# EAGLE design AccessPanelV4 (EAGLE 8.2.2)
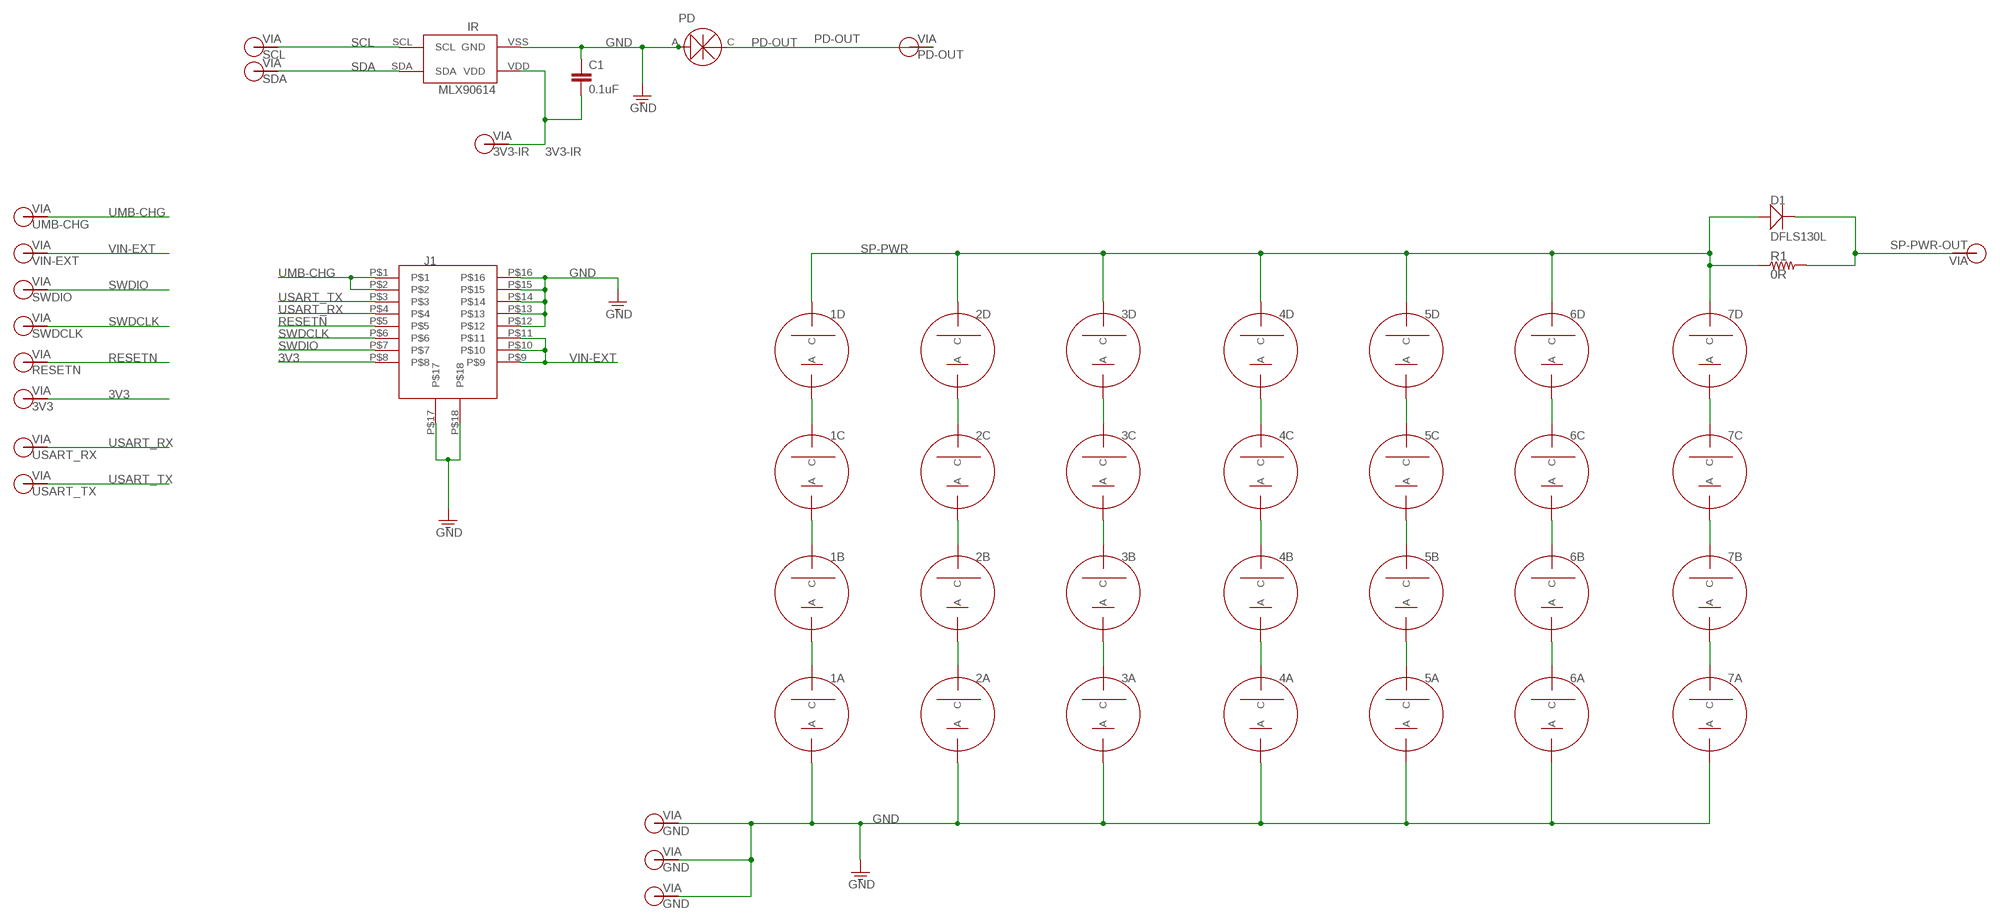
[diagram p0: schematic, sheet 1]

## Parts
1A  SOLARCELLV3  [TRISOLX-V3]
1B  SOLARCELLV3  [TRISOLX-V3]
1C  SOLARCELLV3  [TRISOLX-V3]
1D  SOLARCELLV3  [TRISOLX-V3]
2A  SOLARCELLV3  [TRISOLX-V3]
2B  SOLARCELLV3  [TRISOLX-V3]
2C  SOLARCELLV3  [TRISOLX-V3]
2D  SOLARCELLV3  [TRISOLX-V3]
3A  SOLARCELLV3  [TRISOLX-V3]
3B  SOLARCELLV3  [TRISOLX-V3]
3C  SOLARCELLV3  [TRISOLX-V3]
3D  SOLARCELLV3  [TRISOLX-V3]
4A  SOLARCELLV3  [TRISOLX-V3]
4B  SOLARCELLV3  [TRISOLX-V3]
4C  SOLARCELLV3  [TRISOLX-V3]
4D  SOLARCELLV3  [TRISOLX-V3]
5A  SOLARCELLV3  [TRISOLX-V3]
5B  SOLARCELLV3  [TRISOLX-V3]
5C  SOLARCELLV3  [TRISOLX-V3]
5D  SOLARCELLV3  [TRISOLX-V3]
6A  SOLARCELLV3  [TRISOLX-V3]
6B  SOLARCELLV3  [TRISOLX-V3]
6C  SOLARCELLV3  [TRISOLX-V3]
6D  SOLARCELLV3  [TRISOLX-V3]
7A  SOLARCELLV3  [TRISOLX-V3]
7B  SOLARCELLV3  [TRISOLX-V3]
7C  SOLARCELLV3  [TRISOLX-V3]
7D  SOLARCELLV3  [TRISOLX-V3]
C1  0.1uF  CAP0805  [0805]
D1  DFLS130L  [PWRDI-123]
IR  MXL90614  [MXL90620]
J1  FFC-16  [68611614422]
PD  TEMD6200  [TEMD6200]
R1  0R  RES1210  [1210]
SCL  SCL  VIA-60MIL  [VIA-60MIL]
SDA  SDA  VIA-60MIL  [VIA-60MIL]
V1  SP-PWR-OUT  VIA-60MIL  [VIA-60MIL]
V2  GND  VIA-60MIL  [VIA-60MIL]
V3  3V3-IR  VIA-60MIL  [VIA-60MIL]
V4  GND  VIA-60MIL  [VIA-60MIL]
V5  GND  VIA-60MIL  [VIA-60MIL]
V6  PD-OUT  VIA-60MIL  [VIA-60MIL]
V7  UMB-CHG  VIA-60MIL  [VIA-60MIL]
V8  VIN-EXT  VIA-60MIL  [VIA-60MIL]
V9  SWDIO  VIA-60MIL  [VIA-60MIL]
V10  SWDCLK  VIA-60MIL  [VIA-60MIL]
V11  RESETN  VIA-60MIL  [VIA-60MIL]
V14  USART_RX  VIA-60MIL  [VIA-60MIL]
V15  USART_TX  VIA-60MIL  [VIA-60MIL]
V16  3V3  VIA-60MIL  [VIA-60MIL]

## Nets
3V3: J1.P$8 V16.P$1
3V3-IR: C1.2 IR.VDD V3.P$1
GND: 1A.ANODE(A) 2A.ANODE(A) 3A.ANODE(A) 4A.ANODE(A) 5A.ANODE(A) 6A.ANODE(A) 7A.ANODE(A) C1.1 IR.VSS(GND) J1.P$12 J1.P$13 J1.P$14 J1.P$15 J1.P$16 J1.P$17 J1.P$18 PD.A V2.P$1 V4.P$1 V5.P$1
N$1: 1C.CATHODE(C) 1D.ANODE(A)
N$3: 2C.CATHODE(C) 2D.ANODE(A)
N$4: 3C.CATHODE(C) 3D.ANODE(A)
N$5: 4C.CATHODE(C) 4D.ANODE(A)
N$6: 5C.CATHODE(C) 5D.ANODE(A)
N$7: 1A.CATHODE(C) 1B.ANODE(A)
N$9: 2A.CATHODE(C) 2B.ANODE(A)
N$10: 3A.CATHODE(C) 3B.ANODE(A)
N$11: 4A.CATHODE(C) 4B.ANODE(A)
N$12: 5A.CATHODE(C) 5B.ANODE(A)
N$13: 1B.CATHODE(C) 1C.ANODE(A)
N$15: 2B.CATHODE(C) 2C.ANODE(A)
N$16: 3B.CATHODE(C) 3C.ANODE(A)
N$17: 4B.CATHODE(C) 4C.ANODE(A)
N$18: 5B.CATHODE(C) 5C.ANODE(A)
N$19: 6C.CATHODE(C) 6D.ANODE(A)
N$20: 6A.CATHODE(C) 6B.ANODE(A)
N$21: 6B.CATHODE(C) 6C.ANODE(A)
N$22: 7C.CATHODE(C) 7D.ANODE(A)
N$23: 7A.CATHODE(C) 7B.ANODE(A)
N$24: 7B.CATHODE(C) 7C.ANODE(A)
PD-OUT: PD.C V6.P$1
RESETN: J1.P$5 V11.P$1
SCL: IR.SCL SCL.P$1
SDA: IR.SDA SDA.P$1
SP-PWR: 1D.CATHODE(C) 2D.CATHODE(C) 3D.CATHODE(C) 4D.CATHODE(C) 5D.CATHODE(C) 6D.CATHODE(C) 7D.CATHODE(C) D1.A R1.P$1
SP-PWR-OUT: D1.C R1.P$2 V1.P$1
SWDCLK: J1.P$6 V10.P$1
SWDIO: J1.P$7 V9.P$1
UMB-CHG: J1.P$1 J1.P$2 V7.P$1
USART_RX: J1.P$4 V14.P$1
USART_TX: J1.P$3 V15.P$1
VIN-EXT: J1.P$9 J1.P$10 J1.P$11 V8.P$1

## Notes on the sheet
- GND | PD-OUT

## Library data of the parts
1A 1B 1C 1D 2A 2B 2C 2D 3A 3B 3C 3D 4A 4B 4C 4D 5A 5B 5C 5D 6A 6B 6C 6D 7A 7B 7C 7D = BrownSpaceEngineering:SOLARCELLV3
C1 = CNTRL_BOARD:CAP: Capacitor Standard 0603 ceramic capacitor, and 0.1" leaded capacitor.
D1 = BrownSpaceEngineering:DFLS130L
IR = CNTRL_BOARD:MXL90614
J1 = BrownSpaceEngineering:FFC-16
PD = BrownSpaceEngineering:TEMD6200
R1 = BrownSpaceEngineering:RES
SCL SDA V1-V11 V14-V16 = BrownSpaceEngineering:VIA

## Board
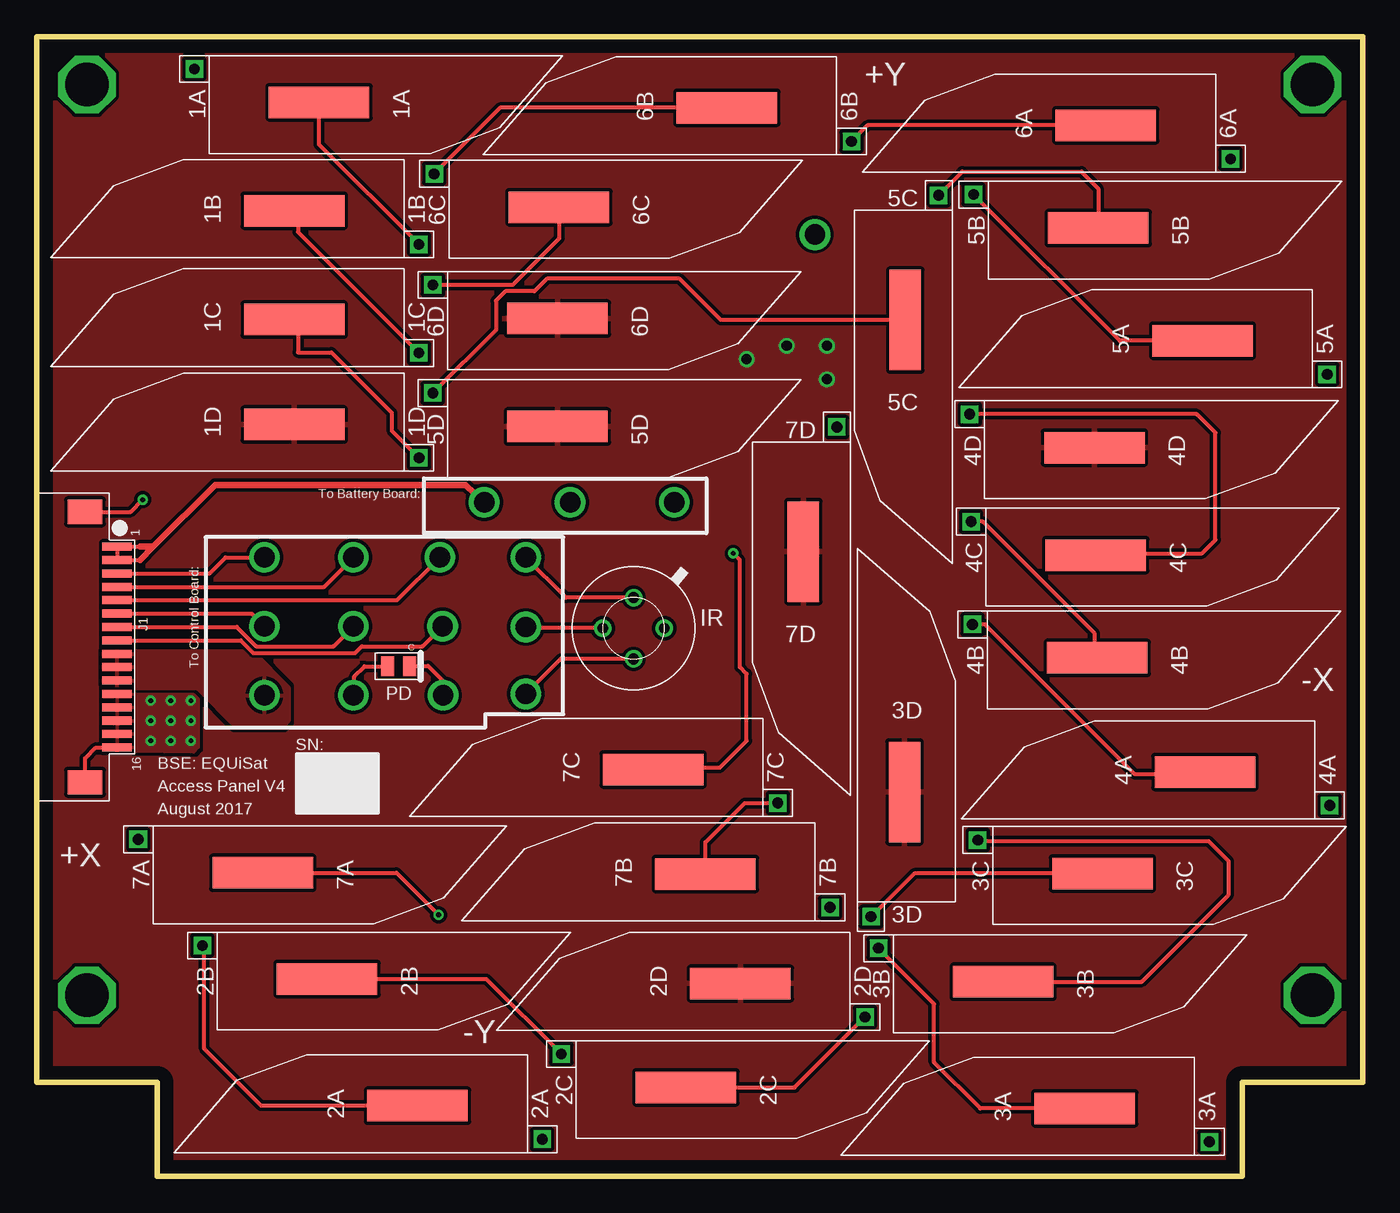
[diagram p1: board, top side]
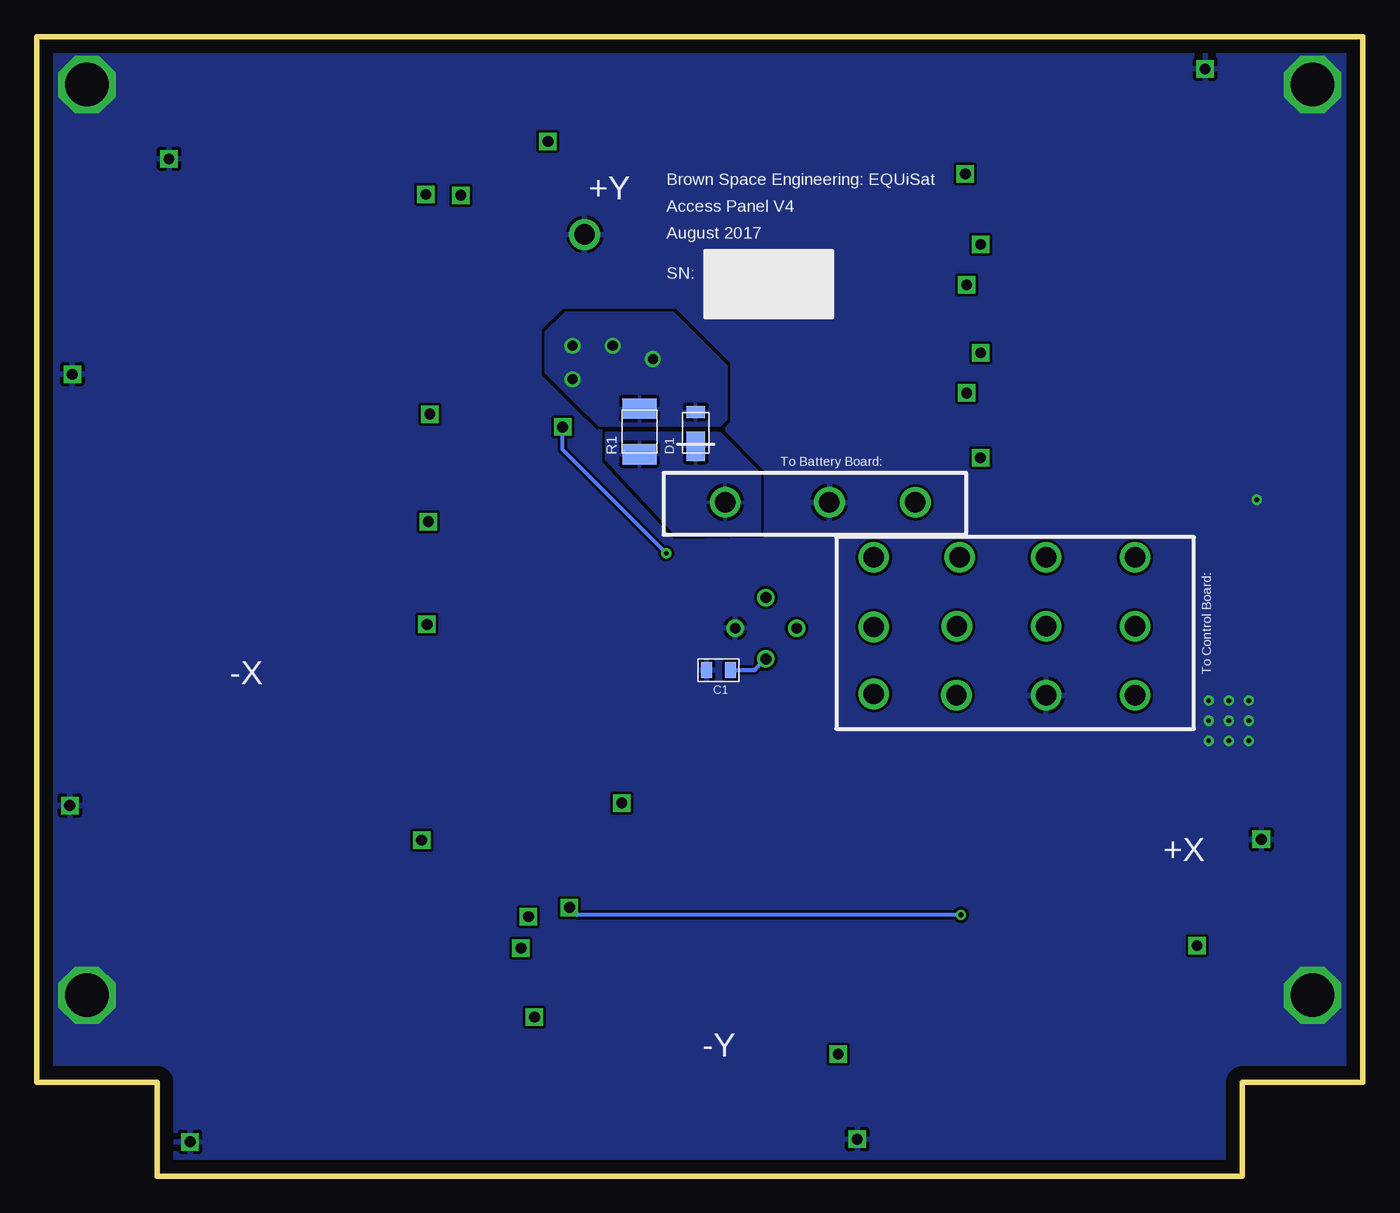
[diagram p2: board, bottom side, seen from below]

Size 99 x 85.07 mm. Coordinates in mm from the lower left corner, seen from the top.
Outline: 9,0 9,7 0,7 0,85.07 99,85.07 99,7 90,7 90,0 9,0
Copper layers (1*16): Top 0.035mm / dielectric 1.5mm / Bottom 0.035mm
Design rules "default": minimum track width 10mil, minimum drill 24mil, track to track 8mil, track to pad 8mil, pad to pad 8mil, via to via 8mil, smd to smd 8mil, copper to edge 40mil, drill to drill 8mil, minimum pad ring 10mil, minimum via ring 8mil, stop-mask expansion 4mil, vias tented up to drill 0mil, thermal gap 10mil

### Footprints (pad centres in the part's own frame; a part is rotated, then mirrored left to right if it is on the bottom)
TRISOLX-V3 = drill 0.8 square: ANODE 13.53,-1.54 | smd 7.5 x 2.35: CATHODE 4.22,0.96
0805 = smd 0.8 x 1.2: 1 -0.9,0; 2 0.9,0
PWRDI-123 = smd 0.9 x 1.4: A 1.45,0 | smd 2.2 x 1.4: C -1.1,0
MXL90620 = drill 0.8: SCL 2.293,0; VDD -2.293,0; VSS 0,-2.294 | drill 0.8 pad 1.2: SDA 0,2.294
68611614422 = smd 0.6 x 2.2: P$1 0,0; P$2 1,0; P$3 2,0; P$4 3,0; P$5 4,0; P$6 5,0; P$7 6,0; P$8 7,0; P$9 8,0; P$10 9,0; P$11 10,0; P$12 11,0; P$13 12,0; P$14 13,0; P$15 14,0; P$16 15,0 | smd 1.8 x 2.6: P$17 17.6,-2.4; P$18 -2.6,-2.4
TEMD6200 = smd 1 x 1.45: A 0.76,0.4; C -0.88,0.4
1210 = smd 1.52 x 2.54: P$1 -1.71,0 | smd 1.51 x 2.54: P$2 1.71,0
VIA-60MIL = drill 1.524: P$1 0,0

### Placement (x,y rotation side)
1A  25.29,81.13 180 top
1B  15,71.11 0 top
1C  15,63 0 top
1D  15.01,55.17 0 top
2A  24.21,4.29 0 top
2B  25.89,15.67 180 top
2C  52.69,7.57 180 top
2D  48.31,13.41 0 top
3A  74.03,4.09 0 top
3B  76.37,15.47 180 top
3C  83.79,23.55 180 top
3D  63.83,32.89 270 top
4A  83.01,29.21 0 top
4B  83.39,39.65 180 top
4C  83.29,47.33 180 top
4D  83.19,55.35 180 top
5A  82.83,61.41 0 top
5B  83.47,71.75 180 top
5C  65.81,59.71 90 top
5D  43.09,56.93 180 top
6A  75.6,77.5 0 top
6B  47.3,78.8 0 top
6C  43.2,73.3 180 top
6D  43.1,65 180 top
7A  21.1,23.6 180 top
7B  45.7,21.6 0 top
7C  41.8,29.4 0 top
7D  58.2,42.4 90 top
C1  48.1,37.78 0 bottom
D1  49.8,55.6 90 bottom
IR  44.56,40.91 90 top
J1  6,47 270 top
PD  26.95,38.47 180 top
R1  54,55.6 270 bottom
SCL  36.5,46.2 180 top
SDA  36.5,41 180 top
V1  47.6,50.3 180 top
V2  39.82,50.3 180 top
V3  36.5,36 0 top
V4  58.1,70.3 180 top
V5  23.65,35.9 180 top
V6  30.34,35.91 180 top
V7  33.4,50.3 180 top
V8  17,35.9 180 top
V9  23.65,41.05 180 top
V10  17,41.05 180 top
V11  30.1,46.2 180 top
V14  23.65,46.2 180 top
V15  17,46.2 180 top
V16  30.3,41.05 180 top

### Tracks (layer width: path | path; a pad name or v marks a point on that pad's centre or on a via)
3V3
  Top 0.3: J1.P$8 15.22,40 16.17,39.05 23.77,39.05 24.27,39.55 28.8,39.55 V16.P$1
3V3-IR
  Top 0.3: IR.VDD 39.11,38.61 V3.P$1
  Bottom 0.3: C1.2 45.4,37.77 IR.VDD
GND  (via drill 0.35, 3.26)
  Top 0.3: J1.P$17 3.6,31.2 4.4,32 J1.P$16 | J1.P$18 7,49.6 v7.9,50.5 | V5.P$1 23.7,35.9 23.7,37.3 24.47,38.07 PD.A
  other vias: 3.75,13.5 95.25,13.5 95.25,81.5 3.75,81.5 10,34 10,35.5 11.5,35.5 11.5,34 11.5,32.5 8.5,35.5 8.5,34 8.5,32.5 10,32.5
  pour Bottom (rank 3): -4.21,107.98 115.7,107.98 116.1,97.91 124.31,97.91 125.31,-15.1 -9.71,-15.1 -9.81,-14.24 -12.11,-14.24 -13.01,98.57 -3.81,98.57
  pour Top (rank 2): 5,36.4 11.9,36.3 12.1,36.1 12.1,32 11.7,31.6 5,31.7
N$1
  Top 0.3: 1D.ANODE 26.5,55.67 26.5,57 22,61.5 19.5,61.5 19.5,63.68 1C.CATHODE 21.04,63.96 22,63
N$3
  Top 0.3: 2C.CATHODE 56.58,6.61 2D.ANODE
N$4
  Top 0.3: 3C.CATHODE 65.52,22.59 3D.ANODE
N$5
  Top 0.3: 4C.CATHODE 79,46.44 79,46.5 87,46.5 88,47.5 88,55.5 86.61,56.89 4D.ANODE
N$6
  Top 0.3: 5C.CATHODE 51.07,63.93 48,67 38.09,67 37.16,66.07 34.98,66.07 34.28,65.36 34.28,63.19 5D.ANODE
N$7
  Top 0.3: 1B.ANODE 21.07,77.03 1A.CATHODE
N$9
  Top 0.3: 2A.CATHODE 16.75,5.25 12.5,9.5 12.5,17.07 2B.ANODE
N$10
  Top 0.3: 3A.CATHODE 70.45,5.05 67,8.5 67,12.85 3B.ANODE
N$11
  Top 0.3: 4A.CATHODE 87.06,30 82,30 70.81,41.19 4B.ANODE
N$12
  Top 0.3: 5A.CATHODE 80.86,62.37 5B.ANODE
N$13
  Top 0.3: 28.04,61.46 1C.ANODE 19.5,70.49 19.5,71.79 1B.CATHODE
N$15
  Top 0.3: 2B.CATHODE 33.56,14.71 2C.ANODE
N$16
  Top 0.3: 3B.CATHODE 82.51,14.51 89,21 89,23.5 87.5,25 70.35,25 3C.ANODE
N$17
  Top 0.3: 4B.CATHODE 79,38.86 79,40.5 70.63,48.87 4C.ANODE
N$18
  Top 0.3: 79.25,71.25 5B.CATHODE 79.25,73.75 78,75 69.11,75 5C.ANODE
N$19
  Top 0.3: 6C.CATHODE 38.98,70.02 39,70 35.54,66.54 6D.ANODE
N$20
  Top 0.3: 6A.CATHODE 62.03,78.46 6B.ANODE
N$21
  Top 0.3: 6B.CATHODE 34.59,79.76 6C.ANODE
N$22  (via drill 0.35)
  Top 0.3: 7C.CATHODE 46.16,30.5 51,30.5 53,32.5 53,37.5 52.5,38 52.5,46 v52,46.5
  Bottom 0.3: v52,46.5 59.74,54.24 7D.ANODE
N$23  (via drill 0.35)
  Top 0.3: 7A.CATHODE 26.86,22.64 v30,19.5
  Bottom 0.3: v30,19.5 58.67,19.5 7B.ANODE
N$24
  Top 0.3: 7B.CATHODE 49.92,24.92 52.86,27.86 7C.ANODE
N$25
  Top 0.25: 99,85.07 99,7 90,7 90,0 9,0 9,7 0,7 0,85.07 99,85.07
PD-OUT
  Top 0.3: PD.C 27.86,38.1 29.2,38.1 30.34,36.96 V6.P$1
RESETN
  Top 0.3: J1.P$5 26.9,43 V11.P$1
SCL
  Top 0.3: IR.SCL 39.5,43.2 SCL.P$1
SDA
  Top 0.3: IR.SDA 36.59,40.91 SDA.P$1
SP-PWR  (via drill 0.76)
  other vias: 53,61 56,62 59,59.5 59,62
  pour Top (isolate 0.254, rank 3): 107.53,106.8 107.53,-30.08 -18.98,-26.28 -13,105.8
  pour Bottom (rank 2): 47.5,56.5 48,56 57,56 58.5,57.5 61,60 61,63 59.5,64.5 51.5,64.5 47.5,60.5
SP-PWR-OUT
  pour Bottom: 48,55.5 45,52.5 45,47.9 45.6,47.9 51.2,47.8 56.5,53.5 56.5,55.5
SWDCLK
  Top 0.3: J1.P$6 16.05,42 V10.P$1
SWDIO
  Top 0.3: J1.P$7 14.93,41 16.38,39.55 22.15,39.55 V9.P$1
UMB-CHG
  Top 0.3: 7.7,46 J1.P$2 J1.P$1 7.7,47
  Top 0.5: 8.7,47 7.7,47 | 8.7,47 13.3,51.6 32,51.6 V7.P$1 | 7.7,46 8.7,47
USART_RX
  Top 0.3: J1.P$4 21.45,44 V14.P$1
USART_TX
  Top 0.3: J1.P$3 12.9,45 14.1,46.2 V15.P$1
VIN-EXT
  pour Top: 5,39.2 16.1,39.2 18.8,36.5 18.8,34 18.3,33.5 14.9,33.5 12,36.4 5,36.4

### Text on the board
tPlace: To Battery Board: | To Control Board:
bPlace: To Battery Board: | To Control Board:
tNames: +Y | -X | SN: | BSE: EQUiSat | Access Panel V4 | August 2017 | +X | -Y
bNames: Brown Space Engineering: EQUiSat | +Y | Access Panel V4 | August 2017 | SN: | -X | +X | -Y